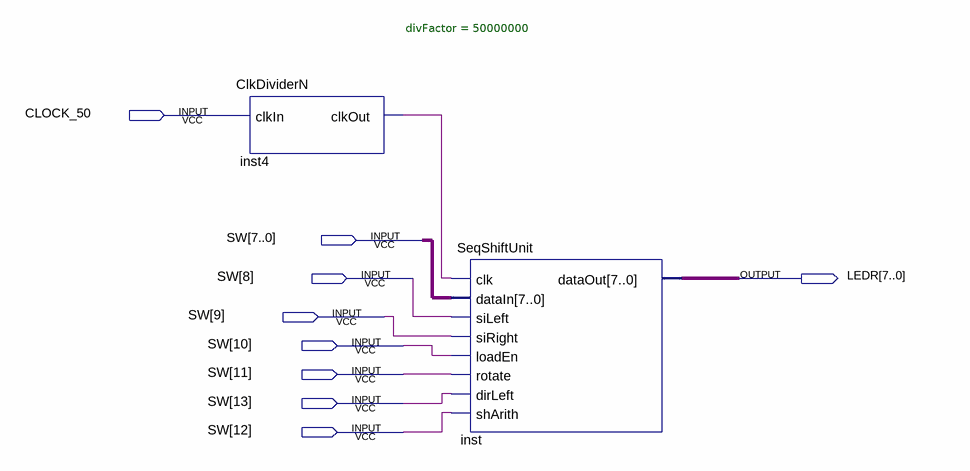
[diagram p0: schematic sheet]
// Quartus schematic SeqShiftUnit_Demo.bdf as structural Verilog: 2 symbols, 9 pins
module SeqShiftUnit_Demo (
  input  CLOCK_50,
  input  [13:0] SW,
  output [7:0] LEDR
);

  wire inst4_clkout;

  ClkDividerN #(.divFactor(50000000)) inst4 (.clkIn(CLOCK_50), .clkOut(inst4_clkout));
  SeqShiftUnit inst (
    .clk(inst4_clkout), .dataIn(SW[7:0]), .siLeft(SW[8]), .siRight(SW[9]), .loadEn(SW[10]), .rotate(SW[11]),
    .dirLeft(SW[13]), .shArith(SW[12]), .dataOut(LEDR));
endmodule
